# Altium schematic sheet RS232_RS485_IrDA.SchDoc
size A4; Revision: C.2
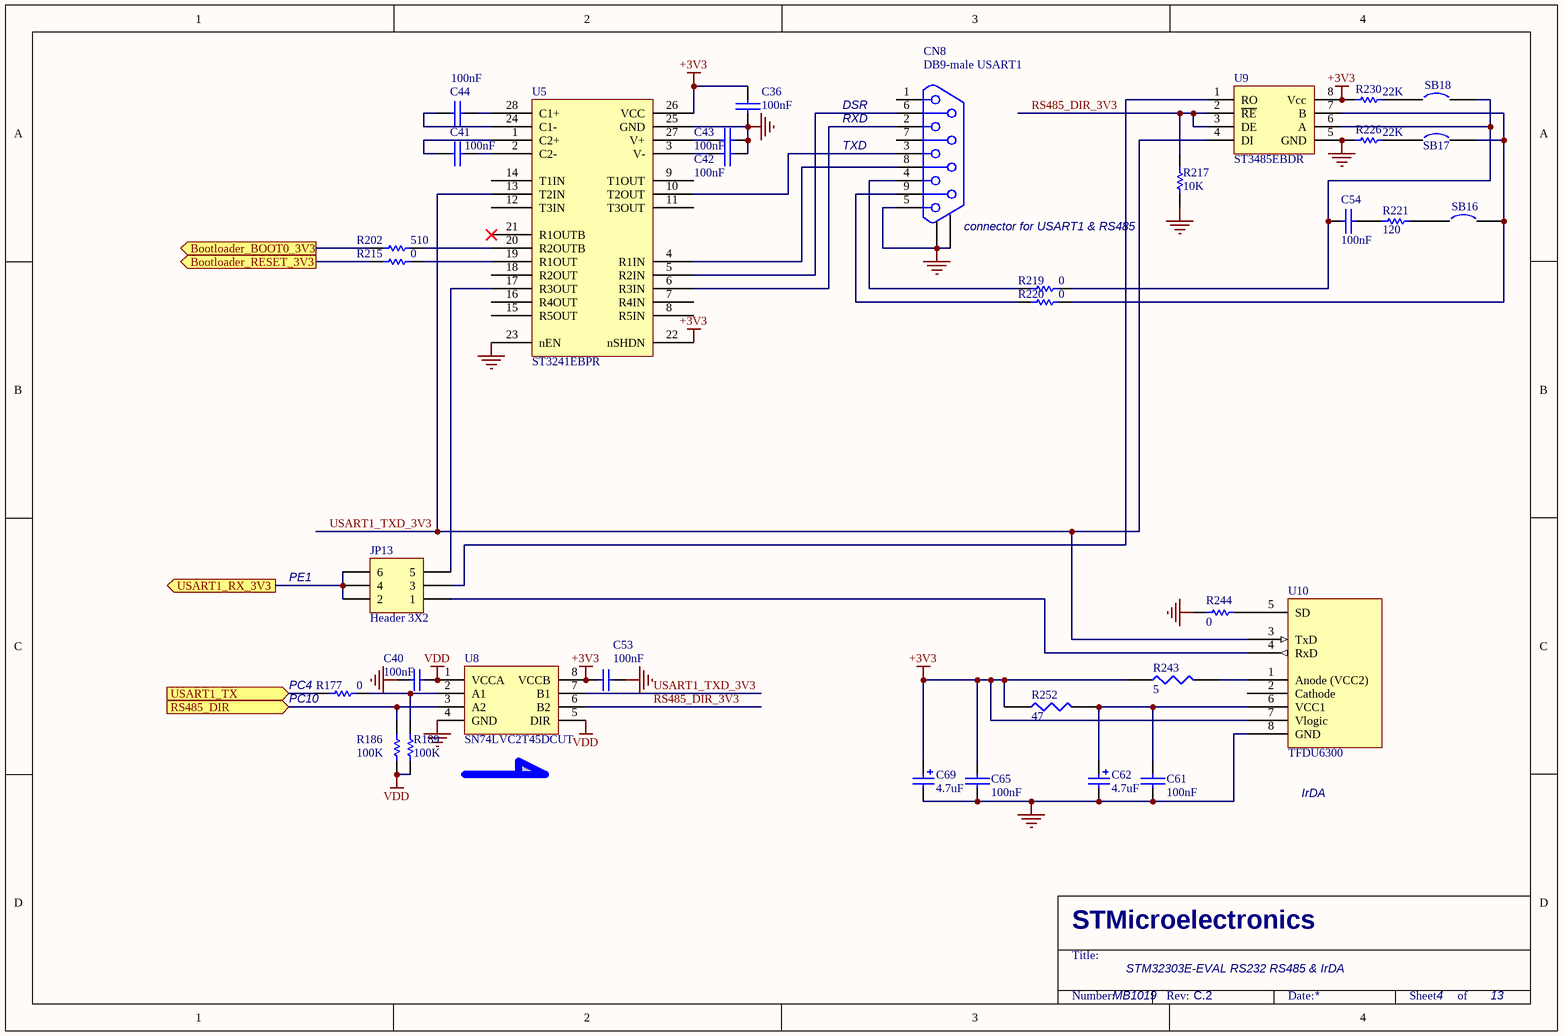
[diagram p0: RS232_RS485_IrDA.SchDoc]

## Parts
C36  100nF  [0603C]
C40  100nF  [0603C]
C41  100nF  [0603C]
C42  100nF  [0603C]
C43  100nF  [0603C]
C44  100nF  [0603C]
C53  100nF  [0603C]
C54  100nF  [0603C]
C61  100nF  [0603C]
C62  4.7uF  [TAN-A]
C65  100nF  [0603C]
C69  4.7uF  [TAN-A]
CN8  DB9-male USART1  [DB9/M]
JP13  Header 3X2  [2*3P]
R177  0  [0603R]
R186  100K  [0603R]
R189  100K  [0603R]
R202  510  [0603R]
R215  0  [0603R]
R217  10K  [0603R]
R219  0  [0603R]
R220  0  [0603R]
R221  120  [0603R]
R226  22K  [0603R]
R230  22K  [0603R]
R243  5  [0603R]
R244  0  [0603R]
R252  47  [0603R]
SB16  (no value)  [JP2_SMD]
SB17  (no value)  [JP2_SMD]
SB18  (no value)  [JP2_SMD]
U5  ST3241EBPR  [SSOP28]
U8  SN74LVC2T45DCUT  [VSSOP8]
U9  ST3485EBDR  [SO8]
U10  TFDU6300  [IR_VISHAY3]

## Ports
Bootloader_BOOT0_3V3 (out), Bootloader_RESET_3V3 (out), RS485_DIR (in), USART1_RX_3V3 (out), USART1_TX (in)

## Nets
+3V3: C36.2 C53.2 C65.1 C69.1 R230.2 R243.1 R252.1 U5.22(nSHDN) U5.26(VCC) U8.8(VCCB) U9.8(Vcc) U10.7(Vlogic)
GND: C36.1 C40.1 C42.2 C43.2 C53.1 C61.2 C62.2 C65.2 C69.2 CN8.0 CN8.5 R217.1 R226.2 R244.2 U5.23(nEN) U5.25(GND) U8.4(GND) U9.5(GND) U10.8(GND)
VDD: C40.2 R186.2 R189.2 U8.1(VCCA) U8.5(DIR)
Bootloader_BOOT0_3V3: R202.1 ; port Bootloader_BOOT0_3V3
Bootloader_RESET_3V3: R215.1 ; port Bootloader_RESET_3V3
RS485_DIR: R186.1 U8.3(A2) ; port RS485_DIR
RS485_DIR_3V3: R217.2 U8.6(B2) U9.2(~{RE}) U9.3(DE)
USART1_RX_3V3: JP13.2 JP13.4 JP13.6 ; port USART1_RX_3V3
USART1_TX: R177.2 ; port USART1_TX
USART1_TXD_3V3: U5.13(T2IN) U8.7(B1) U9.4(DI) U10.3(TxD)
NetC41_1: C41.1 U5.1(C2+)
NetC41_2: C41.2 U5.2(C2-)
NetC42_1: C42.1 U5.3(V-)
NetC43_1: C43.1 U5.27(V+)
NetC44_1: C44.1 U5.24(C1-)
NetC44_2: C44.2 U5.28(C1+)
NetC54_1: C54.1 R221.1
NetC54_2: C54.2 R219.1 SB18.2 U9.6(A)
NetC61_1: C61.1 C62.1 R252.2 U10.6(VCC1)
NetCN8_2: CN8.2 U5.6(R3IN)
NetCN8_3: CN8.3 U5.10(T2OUT)
NetCN8_4: CN8.4 R219.2
NetCN8_6: CN8.6 U5.5(R2IN)
NetCN8_8: CN8.8 U5.4(R1IN)
NetCN8_9: CN8.9 R220.2
NetJP13_1: JP13.1 U10.4(RxD)
NetJP13_3: JP13.3 U9.1(RO)
NetJP13_5: JP13.5 U5.17(R3OUT)
NetR177_1: R177.1 R189.1 U8.2(A1)
NetR202_2: R202.2 U5.20(R2OUTB)
NetR215_2: R215.2 U5.19(R1OUT)
NetR220_1: R220.1 SB16.2 SB17.2 U9.7(B)
NetR221_2: R221.2 SB16.1
NetR226_1: R226.1 SB17.1
NetR230_1: R230.1 SB18.1
NetR243_2: R243.2 U10.1(Anode_(VCC2))
NetR244_1: R244.1 U10.5(SD)

Not connected (* = marked no-connect by the designer): CN8 1 7; U5 7(R4IN) 8(R5IN) 9(T1OUT) 11(T3OUT) 12(T3IN) 14(T1IN) 15(R5OUT) 16(R4OUT) 18(R2OUT) 21(R1OUTB)*; U10 2(Cathode)

## Notes on the sheet
- DSR
- RXD
- TXD
- (near CN8) connector for USART1 & RS485
- PE1
- (near R177) PC4
- (near R177) PC10
- IrDA
- STM32303E-EVAL RS232 RS485 & IrDA
- MB1019
- 4
- 13
- STMicroelectronics
- Title:
- Number:
- Rev:
- Date:
- Sheet       of

## Library data of the parts
C36 C41-C44 C54 C61 C65 = CAP: Capacitor
C40 C53 = CAP: Capacitor; Value: 100pF; Published: 8-Jun-2000; Revision: July-2002: Re-released for DXP Platform.; Publisher: Altium Limited
C62 C69 = Cap Pol1: Polarized Capacitor (Radial); Value: 100pF; Published: 8-Jun-2000; Revision: July-2002: Re-released for DXP Platform.; Publisher: Altium Limited
CN8 = DB9
JP13 = Header 3X2: Header, 3-Pin, Dual row; Revision: 17-Jul-2002: Re-released for DXP Platform.; Publisher: Altium Limited
R177 = res1: Resistor; Value: 1K; Published: 8-Jun-2000; Revision: July-2002: Re-released for DXP Platform.; Publisher: Altium Limited
R186 R189 R202 R215 R217 R219-R221 R226 R230 R244 = Res1: Resistor; Value: 1K; Published: 8-Jun-2000; Revision: July-2002: Re-released for DXP Platform.; Publisher: Altium Limited
R243 R252 = RES1
SB16-SB18 = Circuit Breaker: Published: 24-Mar-1999; Revision: July-2002: Re-released for DXP Platform.; Publisher: Altium Limited
U5 = ST3241
U9 = ST485ABDR
U10 = TFDU4300